# EAGLE board megacommand24 (EAGLE 7.6.0)
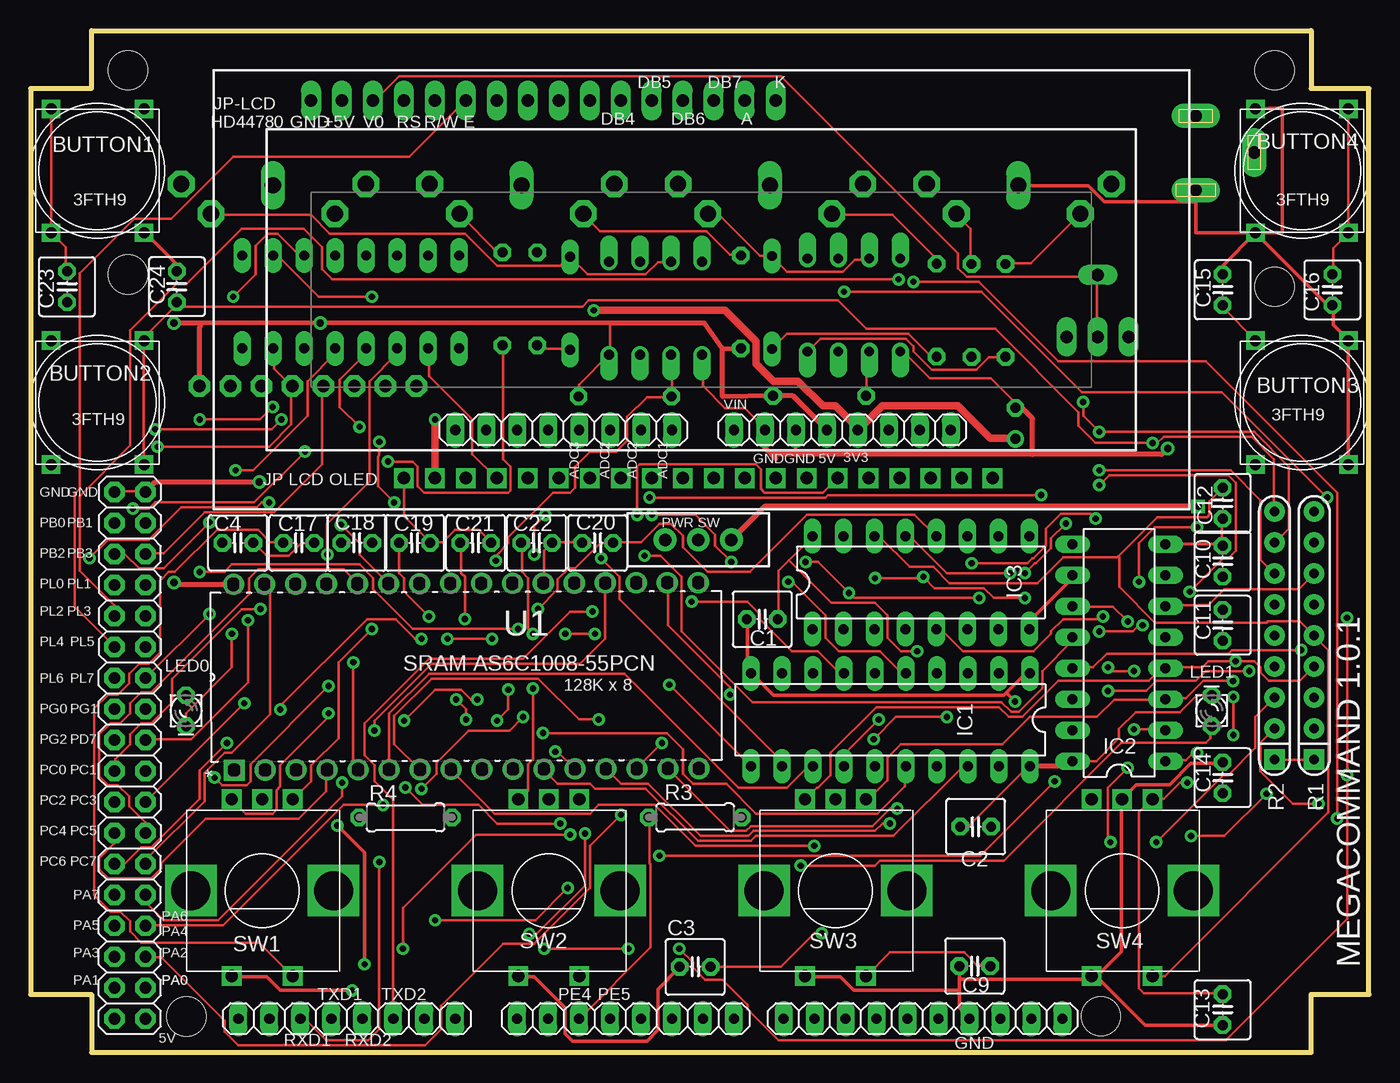
[diagram p5: board, top side]
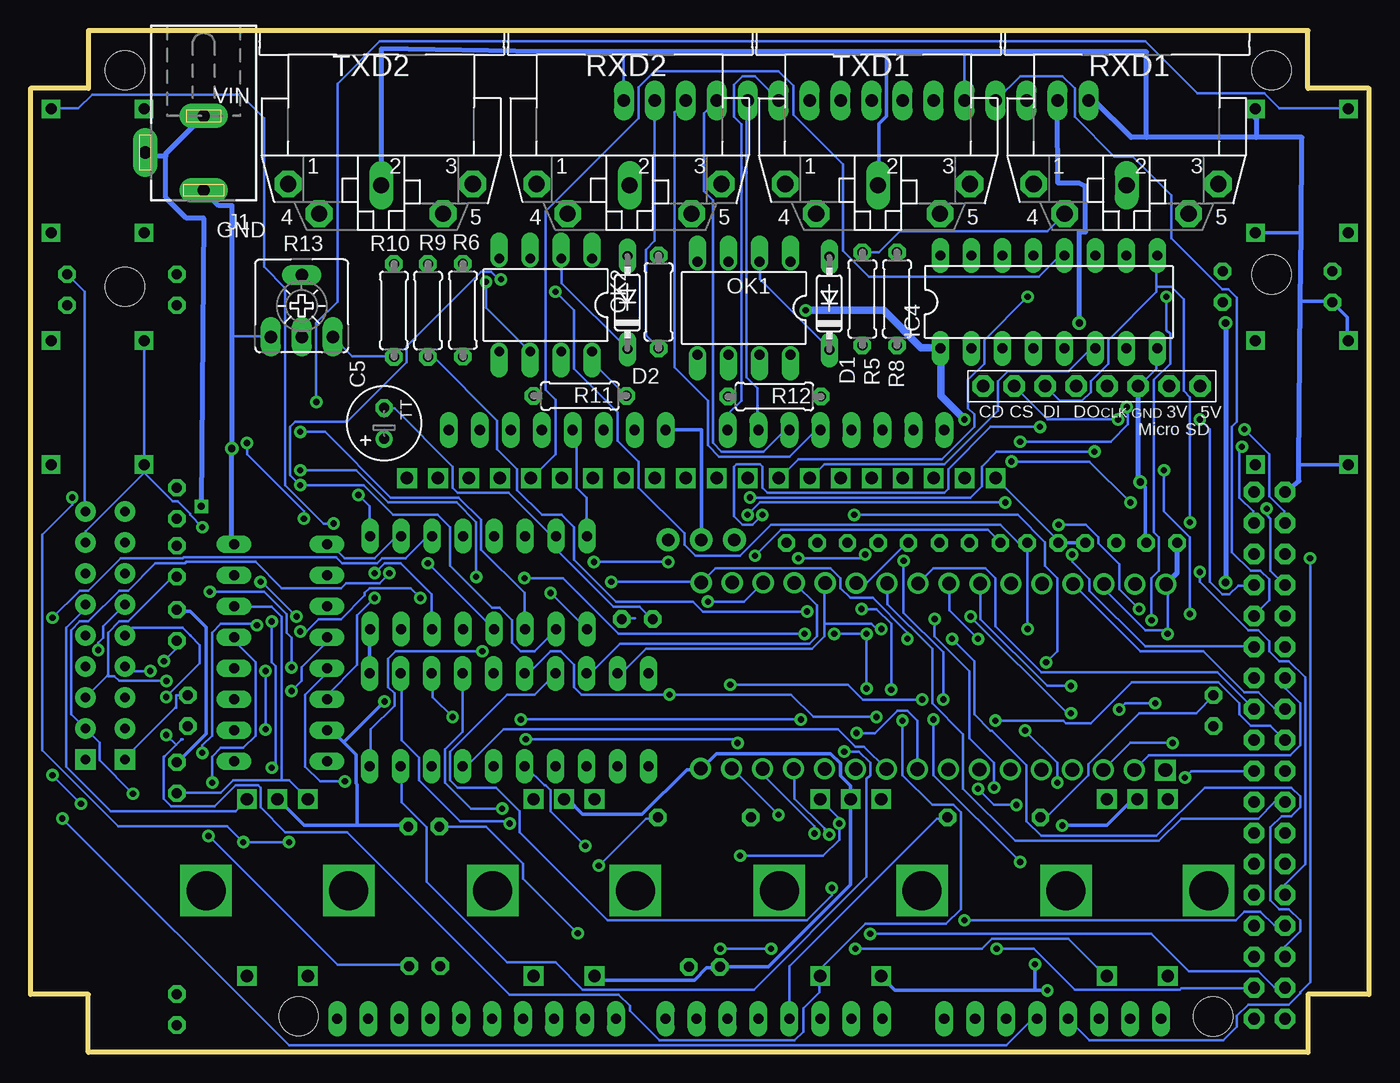
[diagram p6: board, bottom side, seen from below]

Size 109.75 x 83.75 mm. Coordinates in mm from the lower left corner, seen from the top.
Outline: 0,79 0,4.75 5,4.75 5,0 105,0 105,4.75 109.75,4.75 109.75,79 105,79 105,83.75 5,83.75 5,79 0,79
Copper layers (1*16): Top 0.035mm / dielectric 1.5mm / Bottom 0.035mm
Design rules "SparkFun": minimum track width 8mil, minimum drill 20mil, track to track 8mil, track to pad 8mil, pad to pad 8mil, via to via 8mil, smd to smd 8mil, copper to edge 10mil, drill to drill 8mil, minimum pad ring 12mil, minimum via ring 10mil, stop-mask expansion 4mil, vias tented up to drill 25mil, thermal gap 10mil
Net classes: 0 default: width 0.203 mm, drill 0.406 mm, clearance 0.203 mm; 1 power: width 0.61 mm, drill 0.406 mm, clearance 0.203 mm; 2 gnd: width 0.305 mm, drill 0.406 mm, clearance 0.203 mm; 3 power usb: width 0.508 mm, drill 0.406 mm, clearance 0.203 mm
Holes 3.2 mm at 87.77,2.95 12.79,2.92 8,63.75 102,62.75 8,80.5 102,80.5

## Footprints (pad centres in the part's own frame; a part is rotated, then mirrored left to right if it is on the bottom)
1X08 = drill 0.85 pad 1.422 long: 1 -8.89,0; 2 -6.35,0; 3 -3.81,0; 4 -1.27,0; 5 1.27,0; 6 3.81,0; 7 6.35,0; 8 8.89,0
3FT = drill 0.9 square: P$1 5.08,3.81; P$2 -5.08,3.81; P$3 5.08,-3.81; P$4 -5.08,-3.81
C025-050X050 = drill 0.813 octagon: 1 -1.27,0; 2 1.27,0
TT2D6 = drill 0.813: + -1.27,0 | drill 0.813 octagon: - 1.27,0
DO35-7 = drill 0.813 long: A 3.81,0; C -3.81,0
DIL20 = drill 0.813 long: 1 -11.43,-3.81; 2 -8.89,-3.81; 3 -6.35,-3.81; 4 -3.81,-3.81; 5 -1.27,-3.81; 6 1.27,-3.81; 7 3.81,-3.81; 8 6.35,-3.81; 9 8.89,-3.81; 10 11.43,-3.81; 11 11.43,3.81; 12 8.89,3.81; 13 6.35,3.81; 14 3.81,3.81; 15 1.27,3.81; 16 -1.27,3.81; 17 -3.81,3.81; 18 -6.35,3.81; 19 -8.89,3.81; 20 -11.43,3.81
DIL16 = drill 0.813 long: 1 -8.89,-3.81; 2 -6.35,-3.81; 3 -3.81,-3.81; 4 -1.27,-3.81; 5 1.27,-3.81; 6 3.81,-3.81; 7 6.35,-3.81; 8 8.89,-3.81; 9 8.89,3.81; 10 6.35,3.81; 11 3.81,3.81; 12 1.27,3.81; 13 -1.27,3.81; 14 -3.81,3.81; 15 -6.35,3.81; 16 -8.89,3.81
DCJ0202 = drill 1 pad 2 long: 1 0,3.1; 2 4.8,0; 3 0,-3
1X08-BIG = drill 1.016 pad 1.778 octagon: 1 -8.89,0; 2 -6.35,0; 3 -3.81,0; 4 -1.27,0; 5 1.27,0; 6 3.81,0; 7 6.35,0; 8 8.89,0
1X10 = drill 0.85 pad 1.422 long: 1 -11.43,0; 2 -8.89,0; 3 -6.35,0; 4 -3.81,0; 5 -1.27,0; 6 1.27,0; 7 3.81,0; 8 6.35,0; 9 8.89,0; 10 11.43,0
LED_LD260 = drill 0.813 octagon: A -1.27,0; K 1.27,0
DIL08 = drill 0.813 offset: 1 -3.81,-3.81; 2 -1.27,-3.81; 3 1.27,-3.81; 4 3.81,-3.81; 5 3.81,3.81; 6 1.27,3.81; 7 -1.27,3.81; 8 -3.81,3.81
RPACK-SIP-PTH-8 = drill 0.8 pad 1.676 square: P$1 0,0 | drill 0.8 pad 1.676: P$2 0,-2.54; P$3 0,-5.08; P$4 0,-7.62; P$5 0,-10.16; P$6 0,-12.7; P$7 0,-15.24; P$8 0,-17.78; P$9 0,-20.32
0207/7 = drill 0.813 octagon: 1 -3.81,0; 2 3.81,0
CA6V = drill 1.016 long: A -2.54,-2.54; E 2.54,-2.54; S 0,2.54; S1 0,-2.54
SWITCH-SPDT_KIT = drill 1.016 pad 1.88: 1 0,2.718; 2 0,0; 3 0,-2.718
ALPS_EC12E_SW = drill 1 square: A -2.5,-7.5; B 2.5,-7.5; C 0,-7.5; D -2.5,7; E 2.5,7 | drill 3.2 square: GND1 -5.85,0; GND2 5.85,0
DIP254P1524X393-32 = drill 1.118 square: 1 -15.24,38.1 | drill 1.118: 2 -15.24,35.56; 3 -15.24,33.02; 4 -15.24,30.48; 5 -15.24,27.94; 6 -15.24,25.4; 7 -15.24,22.86; 8 -15.24,20.32; 9 -15.24,17.78; 10 -15.24,15.24; 11 -15.24,12.7; 12 -15.24,10.16; 13 -15.24,7.62; 14 -15.24,5.08; 15 -15.24,2.54; 16 -15.24,0; 17 0,0; 18 0,2.54; 19 0,5.08; 20 0,7.62; 21 0,10.16; 22 0,12.7; 23 0,15.24; 24 0,17.78; 25 0,20.32; 26 0,22.86; 27 0,25.4; 28 0,27.94; 29 0,30.48; 30 0,33.02; 31 0,35.56; 32 0,38.1
LCD-16X2-3HOLES = drill 1.016 long: 1 -32,15.5; 2 -29.46,15.5; 3 -26.92,15.5; 4 -24.38,15.5; 5 -21.84,15.5; 6 -19.3,15.5; 7 -16.76,15.5; 8 -14.22,15.5; 9 -11.68,15.5; 10 -9.14,15.5; 11 -6.6,15.5; 12 -4.06,15.5; 13 -1.52,15.5; 14 1.02,15.5; 15 3.56,15.5; 16 6.1,15.5
20PIN = drill 1.016 square: P$1 -24.13,0; P$2 -21.59,0; P$3 -19.05,0; P$4 -16.51,0; P$5 -13.97,0; P$6 -11.43,0; P$7 -8.89,0; P$8 -6.35,0; P$9 -3.81,0; P$10 -1.27,0; P$11 1.27,0; P$12 3.81,0; P$13 6.35,0; P$14 8.89,0; P$15 11.43,0; P$16 13.97,0; P$17 16.51,0; P$18 19.05,0; P$19 21.59,0; P$20 24.13,0
CP-2350 = drill 1.321 pad 2.184 octagon: 1 7.62,12.58; 3 -7.52,12.58; 4 5.08,15.02; 5 -5.08,15.02 | drill 1.321 long: 2 0,12.68
2X18 = drill 0.95 pad 1.676 octagon: 1 -21.59,-1.27; 2 -21.59,1.27; 3 -19.05,-1.27; 4 -19.05,1.27; 5 -16.51,-1.27; 6 -16.51,1.27; 7 -13.97,-1.27; 8 -13.97,1.27; 9 -11.43,-1.27; 10 -11.43,1.27; 11 -8.89,-1.27; 12 -8.89,1.27; 13 -6.35,-1.27; 14 -6.35,1.27; 15 -3.81,-1.27; 16 -3.81,1.27; 17 -1.27,-1.27; 18 -1.27,1.27; 19 1.27,-1.27; 20 1.27,1.27; 21 3.81,-1.27; 22 3.81,1.27; 23 6.35,-1.27; 24 6.35,1.27; 25 8.89,-1.27; 26 8.89,1.27; 27 11.43,-1.27; 28 11.43,1.27; 29 13.97,-1.27; 30 13.97,1.27; 31 16.51,-1.27; 32 16.51,1.27; 33 19.05,-1.27; 34 19.05,1.27; 35 21.59,-1.27; 36 21.59,1.27

## Placement (x,y rotation side)
ADCL  8x1F-H8.5  [1X08]  43.71,51.01 180 top
BUTTON1  3FT1D  [3FT]  5.5,72.25 270 top
BUTTON2  3FT1D  [3FT]  5.5,53.25 90 top
BUTTON3  3FT1D  [3FT]  104.25,53.25 90 top
BUTTON4  3FT1D  [3FT]  104.25,72.25 90 top
C1  0.1uF  [C025-050X050]  60,35.5 0 top
C2  0.1uF  [C025-050X050]  77.5,18.5 180 top
C3  0.1uF  [C025-050X050]  54.5,7 0 top
C4  0.1uF  [C025-050X050]  17,41.75 180 top
C5  220uF  [TT2D6]  80.75,51.55 90 bottom
C9  0.1uF  [C025-050X050]  77.42,7.07 0 top
C10  0.1uF  [C025-050X050]  97.75,40.25 270 top
C11  0.1uF  [C025-050X050]  97.75,35 270 top
C12  0.1uF  [C025-050X050]  97.75,45 90 top
C13  0.1uF  [C025-050X050]  97.75,3.5 90 top
C14  0.1uF  [C025-050X050]  97.75,22.5 270 top
C15  0.1uF  [C025-050X050]  97.75,62.5 270 top
C16  0.1uF  [C025-050X050]  106.75,62.5 90 top
C17  0.1uF  [C025-050X050]  22,41.75 180 top
C18  0.1uF  [C025-050X050]  26.75,41.75 0 top
C19  0.1uF  [C025-050X050]  31.5,41.75 180 top
C20  0.1uF  [C025-050X050]  46.5,41.75 0 top
C21  0.1uF  [C025-050X050]  36.5,41.75 180 top
C22  0.1uF  [C025-050X050]  41.5,41.75 180 top
C23  0.1uF  [C025-050X050]  3,62.75 90 top
C24  0.1uF  [C025-050X050]  12,62.75 270 top
COMMUNICATION  8x1F-H8.5  [1X08]  25.93,2.75 0 top
D1  1N4148  [DO35-7]  44.25,61.38 90 bottom
D2  1N4148  [DO35-7]  60.8,61.46 90 bottom
IC1  74HC573N  [DIL20]  70.5,27.25 180 top
IC2  74LS165N  [DIL16]  89.25,32.75 90 top
IC3  74LS165N  [DIL16]  73,38.5 0 top
IC4  HC4050  [DIL16]  26.25,61.5 0 bottom
J1  DCJ0202  [DCJ0202]  95.55,73.75 180 bottom
JP1  [1X08-BIG]  22.74,54.61 180 bottom
JP6  10x1F-H8.5  [1X10]  73.17,2.75 180 top
LED0  5mm LED  [LED_LD260]  12.75,28 270 top
LED1  5mm LED  [LED_LD260]  96.85,28 90 top
OK1  6N137  [DIL08]  51.25,61 180 bottom
OK2  6N137  [DIL08]  67.5,61.25 180 bottom
POWER  8x1F-H8.5  [1X08]  66.57,51.01 180 top
PWML  8x1F-H8.5  [1X08]  48.79,2.75 0 top
R1  4609X-AP1-103LF  [RPACK-SIP-PTH-8]  105.25,24 180 top
R2  10K 4609X-AP1-103LF  [RPACK-SIP-PTH-8]  102,24 180 top
R3  220  [0207/7]  54.5,19.25 0 top
R4  220  [0207/7]  30.75,19.25 180 top
R5  220  [0207/7]  41.55,61.75 270 bottom
R6  220  [0207/7]  74.3,60.83 270 bottom
R7  220  [0207/7]  58.25,61.5 270 bottom
R8  220  [0207/7]  38.7,61.75 270 bottom
R9  220  [0207/7]  77.16,60.8 270 bottom
R10  220  [0207/7]  79.95,60.8 270 bottom
R11  1k  [0207/7]  64.7,53.8 0 bottom
R12  1k  [0207/7]  48.75,53.75 0 bottom
R13  10k  [CA6V]  87.51,61.18 0 bottom
S1  EG1218  [SWITCH-SPDT_KIT]  54.75,42 90 top
SW1  PEC11  [ALPS_EC12E_SW]  19,13.25 180 top
SW2  PEC11  [ALPS_EC12E_SW]  42.5,13.25 180 top
SW3  PEC11  [ALPS_EC12E_SW]  66,13.25 180 top
SW4  PEC11  [ALPS_EC12E_SW]  89.5,13.25 180 top
U1  [DIP254P1524X393-32]  54.75,38.5 90.2 top
U$1  LCD-HD4478016X2-3-HOLES  [LCD-16X2-3HOLES]  55,62.5 0 top
U$2  20PIN  [20PIN]  54.75,47.06 0 top
U$7  MIDIJACK  [CP-2350]  81,83.75 180 bottom
U$8  MIDIJACK  [CP-2350]  60.62,83.75 180 bottom
U$9  MIDIJACK  [CP-2350]  40.25,83.75 180 bottom
U$10  MIDIJACK  [CP-2350]  19.88,83.75 180 bottom
XIO  18x2F-H8.5  [2X18]  8.15,24.34 90 top

## Tracks (layer width: path | path; a pad name or v marks a point on that pad's centre or on a via)
+3V3  (via drill 0.51)
  Top 0.61: v33.18,51.87 33.18,47.1 U$2.P$2 | C5.+ 80.72,50.35 78.69,50.35 76.05,52.99 69.85,52.99 67.92,51.06 POWER.4 67.72,51.26 65.99,52.99 64.98,52.99 62.95,55.02 60.91,55.02 59.49,56.44 59.49,58.27 56.95,60.81 v46.18,60.81
  Bottom 0.61: v33.18,51.87 35.11,53.8 35.11,57.66 IC4.1 35.41,57.76 36.73,57.76 39.78,60.81 v46.18,60.81
+5V  (via drill 0.51, 0.6)
  Top 0.203: v64.88,9.75 64.27,9.75 61.52,7.01 55.83,7.01 C3.2 | R1.P$1 105.21,23.98 102.06,23.98 R2.P$1 | 16.01,38.2 U1.32 | 97.49,29.26 97.69,29.26 LED1.K 96.75,29.25 95.62,29.25 94.25,27.88 90.62,27.88 89.25,26.5 89.25,25.75 87.38,23.88 85.62,23.88 IC2.16 85.6,23.98 | C2.2 76.25,18.59 76.97,18.59 81.74,23.37 IC1.20 | R12.2 44.96,53.8 44.96,54.72 47.4,57.15 OK1.8 47.5,57.26 47.5,59.69 47.5,59.77 | 62.18,40.34 64.06,42.22 IC3.16 | 62.18,40.34 61.32,39.48 61.32,35.51 C1.2 | v16.51,34.29 16.51,31.55 12.76,27.79 12.76,26.78 LED0.K | 56.75,57.56 56.85,57.56 56.76,57.68 | R10.2 79.91,56.95 78.59,56.95 77.58,55.94 73.92,55.94 72.39,57.46 72.39,57.87 71.78,58.48 64.77,58.48 63.76,57.46 OK2.8 | v72.7,32.87 71.38,32.87 70.26,33.99 70.26,35.82 69.24,36.83 65.69,36.83 62.18,40.34
  Top 0.406: POWER.5 62.51,53.8 R11.2 56.75,53.75 56.75,57.56 56.75,57.67 | R7.2 56.76,57.68 55.25,59.77 47.5,59.77 v23.75,59.78 14,59.77 | 14,59.77 13.85,59.35 JP1.1 | 14,59.77 v11.75,59.77 | v11.75,38.5 11.88,38.37 U1.32 | IC2.16 85.02,23.44 IC1.20
  Bottom 0.203: v64.88,9.75 69.35,14.22 69.35,15.44 72.39,18.49 76.15,18.49 C2.2 | 97.79,28.25 | 97.79,28.25 97.79,29.26 LED1.K | 101.96,24.08 R2.P$1 102,24.12 97.88,28.25 97.79,28.25 | 60.2,35.56 61.22,35.56 C1.2 | R10.2 80.01,57.05 83.37,57.05 84.89,58.58 R13.E | OK2.8 63.66,57.36 63.66,56.54 60.91,53.8 R11.2 | 16.51,34.6 16.51,38.26 U1.32 | U$1.15 58.58,77.98 58.58,66.5 59.29,65.79 59.29,58.78 58.27,57.76 R7.2 | 16.51,34.6 18.34,34.6 21.7,37.95 21.7,38.36 U1.30 | 16.51,34.6 v16.51,34.29 | IC3.16 64.16,42.32 64.16,45.47 64.98,46.28 64.98,50.65 65.28,50.96 POWER.5 | v72.7,32.87 79.81,32.87 80.42,32.26 80.42,29.93 79.91,29.42 79.91,28.4 81.84,26.47 81.84,23.52 IC1.20
  Bottom 0.406: v11.75,59.77 v11.75,38.5 | U1.32 15.73,39.29 C4.2 | v23.75,59.78 23.75,67.25 23.25,67.25 23.25,71 23.75,71.25 25.5,71.25 25.54,77.04 U$1.2
ADC0
  Bottom 0.203: ADCL.1 52.58,51.06 52.58,52.28 51.46,53.4 51.46,76.05 52.07,76.66 52.07,79.3 51.36,80.01 50.35,80.01 48.42,78.08 U$1.11
ADC1
  Bottom 0.203: ADCL.2 50.14,51.06 50.14,54.41 51.06,55.33 51.06,77.88 50.96,77.98 U$1.12
ADC2
  Bottom 0.203: ADCL.3 47.6,50.96 47.91,50.96 49.64,49.23 53.09,49.23 53.8,49.94 53.8,69.85 54.51,70.56 54.51,76.97 53.5,77.98 U$1.13
ADC3
  Bottom 0.203: ADCL.4 45.06,50.96 45.37,50.96 47.5,48.82 53.29,48.82 54.21,49.74 54.21,53.4 56.95,56.14 56.95,77.07 56.04,77.98 U$1.14
GND  (via drill 0.51, 0.6)
  Top 0.203: C20.1 45.16,41.81 42.83,41.81 C22.1 42.73,41.71 42.12,41.1 42.12,38.46 U1.22 | 32.77,41.81 33.79,41.81 34.8,42.83 36.73,42.83 37.75,41.81 C21.1 | 32.77,41.81 30.64,43.95 30.64,46.99 U$2.P$1 | 32.77,41.81 C19.1 | OK1.5 55.12,57.15 55.12,54.61 56.95,52.78 58.58,52.78 59.69,51.67 POWER.7 | C12.1 97.69,43.64 97.69,41.71 C10.1 | XIO.35 9.3,45.98 6.96,45.98 XIO.36 | C17.1 23.22,41.71 22.2,41.71 21.19,40.7 19.36,40.7 18.34,41.71 C4.1 | 80.83,52.78 C5.- 80.75,53.25 78.75,55.25 73.75,55.25 71.75,57.25 OK2.5
  Top 0.254: C10.1 97.63,41.64 IC2.8
  Top 0.305: v26.37,5.08 20.48,5.08 19.36,6.2 16.51,6.2 SW1.E | v25.15,18.59 27.39,16.36 v27.39,7.21 | IC2.10 85.4,39.01 85.4,38.81 81.94,35.36 81.94,34.75 IC3.8 | C1.1 58.78,35.46 58.78,31.29 58.98,31.09 IC1.10 59.19,30.99 60.91,29.26 79.81,29.26 80.01,29.46 | 80.01,29.46 81.54,30.99 81.84,30.99 IC1.1 | C14.1 97.69,23.67 95.15,23.67 93.42,21.95 90.68,21.95 89.56,20.83 SW4.C 89.46,20.62 89.46,8.23 87.53,6.3 SW4.E | 76.15,5.08 76.15,3.66 76.97,2.85 JP6.4 | 76.15,5.08 76.15,5.99 | 76.15,5.99 76.15,7.01 C9.1 | C13.1 97.69,2.23 91.39,2.23 87.43,6.2 87.02,6.2 SW4.E | 76.15,5.99 86.82,5.99 86.92,6.1 SW4.E | 76.15,5.08 67.52,5.08 66.4,6.2 63.55,6.2 SW3.E | v80.72,28.75 80.01,29.46 | SW2.E 40.09,6.2 41.3,6.2 43.84,3.66 43.84,1.52 44.45,0.91 50.55,0.91 51.46,1.83 51.46,5.18 53.19,6.91 C3.1 | C24.1 11.94,64.11 11.94,64.62 9.4,67.16 BUTTON1.P$1 | 59.8,51.61 60.2,51.21 POWER.7 | 62.74,49 62.74,51 POWER.6 | BUTTON3.P$4 108.06,48.26 108.06,58.22 BUTTON3.P$3 108.06,58.42 106.84,59.64 106.84,61.16 C16.1 106.63,61.27 106.33,61.27 100.54,67.06 BUTTON4.P$2 | 100.44,67.16 97.79,64.52 97.79,63.81 C15.1 | 100.44,67.16 BUTTON4.P$2 | BUTTON4.P$1 102.64,77.42 102.64,67.16 BUTTON4.P$2 | U$7.2 81.03,71.02 86.72,71.02 88.04,69.7 95.55,69.7 J1.1 95.55,67.16 100.44,67.16
  Top 0.406: v93.25,49.5 92.75,49 82.15,49 | 82.15,49 62.74,49 60.75,49 | 60.75,49 60.22,49.53 POWER.7 | 60.75,49 61.1,48.65 | XIO.35 10.24,46.75 v18.75,46.75 | 82.15,49 82.15,51.95 81.28,52.82 C5.-
  Bottom 0.203: C1.1 58.78,35.51 59.8,36.53 61.93,36.53 66.6,41.2 66.6,42.22 IC3.15 66.7,42.32 67.01,42.32 70.56,45.88 74.73,45.88 75.14,46.28 75.14,48.01 79.91,52.78 80.72,52.78 C5.- | U1.22 42.02,38.46 41.2,38.46 37.85,41.81 C21.1 | IC4.8 17.43,57.66 17.43,56.04 18.75,54.72 JP1.3 | 33.18,82 33.18,78.08 U$1.5 | 61.12,82 61.12,78.08 U$1.16 | 93.25,58.68 90.07,58.68 R13.A | U$2.P$1 30.54,46.99 25.45,41.91 C18.1
  Bottom 0.305: 27.39,5.08 38.87,5.08 39.98,6.2 SW2.E | 27.39,5.08 v26.37,5.08 | v25.15,18.59 21.49,18.59 19.36,20.73 19.05,20.73 SW1.C | 27.39,5.08 v27.39,7.21 | IC1.1 81.94,31.09 81.94,34.65 IC3.8 | 82.96,18.59 87.33,18.59 89.46,20.73 SW4.C | 82.96,18.59 78.8,18.59 C2.1 | 84.08,25.4 83.06,24.38 83.06,22.05 82.96,21.95 82.96,18.59 | 84.08,25.4 84.99,26.31 85.4,26.31 IC2.15 | C11.1 97.69,36.17 96.68,36.17 95.36,34.85 95.36,26.11 97.69,23.77 C14.1 | SW3.C 65.99,20.73 65.69,20.73 64.47,19.51 59.59,19.51 55.94,23.16 54.92,23.16 U1.16 54.72,23.27 53.5,24.49 44.15,24.49 43.34,23.67 43.34,22.66 42.52,21.84 42.52,20.83 SW2.C 42.52,20.62 42.52,13.72 49.23,7.01 53.09,7.01 C3.1 53.29,6.91 54.31,6.91 55.33,5.89 63.15,5.89 63.45,6.2 SW3.E | 84.08,25.4 v80.72,28.75 | C4.1 18.34,41.76 18.34,46.33 18.65,46.63 v18.75,46.75 | C18.1 25.45,41.76 23.42,41.76 C17.1 | 5.62,61.57 5.44,61.57 3,61.57 C23.1 2.9,61.37 1.78,60.25 1.78,58.42 BUTTON2.P$1 | BUTTON2.P$2 1.78,48.16 5.54,48.16 5.74,48.16 | 39.58,82 39.58,76.71 40.19,76.1 40.19,71.12 U$9.2 | BUTTON1.P$1 9.3,67.16 5.74,67.16 5.57,67.16
  Bottom 0.406: XIO.36 5.75,46.81 5.74,48.16 5.62,61.57 5.57,67.16 5.5,75 9.25,75 | 9.25,75 18.25,75 | 18.25,75 19.5,75 22.5,78 U$1.1 | BUTTON1.P$2 9.5,77.14 9.5,76.75 9.25,76.5 9.25,75 | 18.25,75 18.25,82 33.18,82 39.58,82 61.12,82 67.75,82 81,82.25 U$7.2 | IC2.8 93.25,41.83 v93.25,49.5 93.25,58.68 93.25,69.41 94.31,69.41 J1.1 | v18.75,46.75 18.93,46.93 JP1.3
INS0  (via drill 0.51)
  Top 0.203: v28,34.7 25.25,31.96 25.25,25.76 23.02,23.52 23.02,22.2 21.59,20.78 SW1.A | v89.97,35.31 88.75,36.53 85.5,36.53 IC2.11 | v89.97,23.32 88.34,21.7 88.34,17.43 v88.55,17.23 | v92.31,17.23 97.79,22.71 98.2,22.71 100.44,24.95 100.44,27.49 101.96,29.01 R2.P$3 | v66.7,62.34 77.98,62.34 86.21,54.11 97.69,54.11 v106.33,45.47
  Bottom 0.203: v28,34.7 28,41.71 C18.2 28.1,41.81 28.81,41.81 30.23,43.23 49.03,43.23 51.57,40.7 55.22,40.7 56.14,41.61 56.14,42.52 59.9,46.28 59.9,48.42 61.62,50.14 61.62,52.48 65.18,56.04 65.18,60.81 v66.7,62.34 | v89.97,35.31 89.97,31.96 89.67,31.65 89.67,23.63 v89.97,23.32 | v88.55,17.23 v92.31,17.23 93.63,18.55 102.57,18.55 108.77,24.74 108.77,42.42 106.33,44.86 v106.33,45.47
INS1  (via drill 0.51)
  Top 0.203: v88.34,29.62 91.5,29.62 92.31,30.43 95.56,30.43 96.37,31.25 v99.93,31.25 | C19.2 30.23,39.27 30.64,38.87 30.64,37.75 v32.67,35.72 | v24.44,27.79 24.44,27.49 20.48,23.52 20.48,21.8 20.17,21.49 20.17,19.87 19.87,19.56 17.63,19.56 16.51,20.68 SW1.B | v50.35,40.7 51.67,40.7 53.4,38.97 53.4,34.5 59.19,28.71 79.61,28.71 80.42,27.89 81.03,27.89 82.96,29.82 82.96,31.25 85.4,33.68 85.4,33.99 IC2.12
  Bottom 0.203: v88.34,29.62 87.53,30.43 87.53,31.55 85.5,33.58 85.5,33.99 IC2.12 | v99.93,31.25 101.66,31.25 101.96,31.55 R2.P$4 | v32.67,35.72 24.74,27.79 v24.44,27.79 | v50.35,40.7 48.21,42.83 31.25,42.83 30.23,41.81 C19.2
INS2  (via drill 0.51)
  Top 0.203: v104.19,32.97 98.5,32.97 98.2,32.67 88.24,32.67 87.13,31.55 85.5,31.55 IC2.13 | v35.62,35.51 35.62,38.97 35.31,39.27 35.31,41.71 C21.2 | v30.74,21.7 32.16,20.27 36.73,20.27 38.26,18.75 v43.44,18.75 | v83.98,22.2 77.88,16.11 v51.57,16.11
  Bottom 0.203: v104.19,32.97 104.19,33.58 103.79,33.99 103.79,34.9 102.06,36.63 R2.P$6 | v35.62,35.51 35.62,34.09 32.77,31.25 32.77,25.76 30.74,23.73 v30.74,21.7 | SW2.A 44.96,20.68 43.44,19.16 v43.44,18.75 43.44,17.43 44.76,16.11 v51.57,16.11 | v83.98,22.2 86.01,22.2 87.23,23.42 87.23,29.32 85.5,31.04 85.5,31.45 IC2.13
INS3  (via drill 0.51)
  Top 0.203: v41.2,34.29 40.8,34.7 40.8,38.87 40.29,39.37 40.29,41.71 C22.2 | v41.2,29.82 41.2,24.03 40.8,23.63 40.8,21.49 40.09,20.78 SW2.B | v81.54,37.24 79,37.24 78.19,38.05 74.12,38.05 v73.21,38.97 73.21,38.87 v69.24,38.87 | v87.63,47.7 98.4,47.7 100.84,45.27 100.84,40.39 101.96,39.27 R2.P$7 | v46.28,34.29 v43.84,34.29
  Bottom 0.203: v41.2,29.82 v41.2,34.29 v43.84,34.29 | v81.54,37.24 82.96,35.82 82.96,31.75 85.4,29.32 85.4,29.01 IC2.14 | v73.21,38.97 73.21,43.44 74.83,45.06 80.42,45.06 83.06,47.7 v87.63,47.7 | v46.28,34.29 61.52,34.29 66.09,38.87 v69.24,38.87
INS4  (via drill 0.51)
  Top 0.203: SW3.A 68.53,20.78 68.74,20.78 70.26,22.3 70.26,24.13 71.38,25.25 79.71,25.25 81.94,27.49 87.43,27.49 88.85,28.91 93.02,28.91 IC2.3 93.12,29.01 94.75,29.01 96.17,30.43 v98.61,30.43
  Bottom 0.203: 103.43,30.89 105.21,29.11 R1.P$3 | 103.43,30.89 103.38,30.94 103.38,34.4 102.47,35.31 101.76,35.31 98.1,38.97 97.79,38.97 C10.2 | v98.61,30.43 102.47,30.43 102.87,30.84 103.38,30.84 103.43,30.89
INS5  (via drill 0.51)
  Top 0.203: R1.P$4 105.21,31.55 104.09,30.43 101.55,30.43 100.84,31.14 100.84,31.55 100.33,32.06 v98.81,32.06 96.58,32.06 96.07,31.55 93.12,31.55 IC2.4 93.02,31.45 92.71,31.45 91.7,30.43 84.28,30.43 81.33,27.49 80.22,27.49 79.4,28.3 69.35,28.3 65.59,24.54 65.59,22.71 64.57,21.7 64.47,21.7 63.55,20.78 SW3.B
  Bottom 0.203: v98.81,32.06 97.79,33.08 97.79,33.68 C11.2
INS6  (via drill 0.51)
  Top 0.203: C13.2 97.69,4.83 91.29,4.83 90.89,5.24 90.89,19.66 91.9,20.68 SW4.A 92,20.78 92.92,20.78 94.24,22.1 v94.85,22.1
  Bottom 0.203: v94.85,22.1 94.85,24.24 94.14,24.95 92.31,24.95 91.29,25.96 91.29,31.96 93.02,33.68 93.02,33.99 IC2.5 | R1.P$6 105.31,36.63 105.31,36.33 106.84,34.8 106.84,23.42 103.18,19.77 92.92,19.77 92,20.68 SW4.A
INS7
  Top 0.203: IC2.6 93.12,36.63 96.58,36.63 97.9,37.95 103.99,37.95 105.21,39.17 R1.P$7
  Bottom 0.203: 89.16,22.3 88.55,22.3 87.02,20.78 SW4.B | 89.16,22.3 93.12,22.3 94.14,21.29 97.69,21.29 C14.2 | 89.16,22.3 89.16,35.72 89.97,36.53 93.02,36.53 IC2.6
INS8  (via drill 0.51)
  Top 0.203: v107.95,35.62 v107.95,22.71 107.95,10.93 98,0.97 61.32,0.97 58.78,3.51 58.78,3.92 56.75,5.95 55.33,5.95 54.31,6.96 54.31,7.37 v53.19,8.49 | v105.62,20.38 103.48,20.38 100.84,23.02 100.84,25.35 101.96,26.47 R2.P$2 | C17.2 20.68,41.81 19.66,41.81 18.65,42.83 15.29,42.83 11.84,39.37 11.33,39.37 10.62,38.66 10.62,32.77 9.71,31.86 8.89,31.86 8.08,31.04 8.08,30.23 7.17,29.32 6.35,29.32 5.24,28.2 5.24,12.86 6.56,11.54 7.37,11.54 8.18,10.72 8.18,9.91 9.1,9 18.75,9 SW1.D | v42.12,8.49 v49.03,8.49
  Bottom 0.203: v107.95,35.62 105.72,37.85 105.01,37.85 102.37,40.49 97.29,40.49 97.18,40.59 84.69,40.59 84.18,40.09 81.33,40.09 80.93,40.49 79,40.49 77.27,42.22 76.86,42.22 IC3.11 | v105.62,20.38 v107.95,22.71 | v49.03,8.49 v53.19,8.49 | v42.12,8.49 31.75,8.49 30.94,9.3 24.64,9.3 21.59,6.25 SW1.D
INS9  (via drill 0.51)
  Top 0.203: IC3.12 74.22,42.32 72.5,44.05 63.66,44.05 58.98,39.37 55.53,39.37 53.5,41.41 53.5,42.32 52.48,43.34 51.57,43.34 50.04,41.81 47.81,41.81 C20.2 47.7,41.71 46.69,41.71 44.66,39.68 44.15,39.68 43.23,38.76 43.23,37.95 v41.61,36.33 | v39.17,29.72 39.17,28.1 v38.26,27.18 | v98.62,29.12 v98.62,26
  Bottom 0.203: 97.29,25.66 97.38,25.66 | 97.38,25.66 97.39,25.66 | R2.P$5 101.96,34.19 101.35,34.8 97.29,34.8 96.68,34.19 96.62,34.12 95.88,33.38 95.88,31.88 v98.62,29.12 | v41.61,36.33 40.39,36.33 39.17,35.11 v39.17,29.72 | v38.26,27.18 38.26,22.71 35.82,20.27 34.09,20.27 33.48,19.66 33.48,11.74 34.7,10.52 41.3,10.52 44.96,6.86 44.96,6.25 SW2.D 45.06,6.15 45.06,4.93 46.38,3.61 46.38,1.68 47.1,0.97 58.17,0.97 60.61,3.41 60.61,3.81 61.52,4.73 70.46,4.73 83.77,18.04 88.85,18.04 90.89,20.07 90.89,21.7 91.09,21.9 92.92,21.9 94.64,20.17 98.2,20.17 98.81,20.78 98.81,24.24 98.75,24.25 97.81,25.19 | 97.81,25.19 97.38,25.62 97.38,25.66 | v98.62,26 97.81,25.19
INS10  (via drill 0.51)
  Top 0.203: C9.2 78.59,7.17 77.58,7.17 76.56,8.18 70.46,8.18 68.53,6.25 SW3.D | v80.32,39.27 75.14,39.27 72.19,42.22 71.78,42.22 IC3.13 | v95.15,17.73 97.9,17.73 v101.35,21.19
  Bottom 0.203: v80.32,39.27 81.13,38.46 83.88,38.46 84.28,38.05 89.16,38.05 91.29,40.19 96.98,40.19 97.08,40.09 99.52,40.09 101.76,37.85 102.47,37.85 105.01,35.31 105.72,35.31 106.43,34.6 106.43,27.69 105.31,26.57 R1.P$2 105.21,26.47 104.09,25.35 104.09,23.93 v101.35,21.19 | v95.15,17.73 84.59,7.17 78.69,7.17 C9.2
INS11
  Top 0.203: 89.21,40.64 92.41,43.84 96.47,43.84 96.68,44.05 96.68,45.16 97.69,46.18 C12.2 | 89.21,40.64 89.16,40.59 84.69,40.59 82.55,38.46 75.34,38.46 74.02,39.78 72.09,39.78 69.65,42.22 69.24,42.22 IC3.14 | SW4.D 93.02,6.25 106.43,19.66 106.43,32.97 105.31,34.09 R1.P$5 105.21,34.19 104.09,35.31 101.45,35.31 101.35,35.21 92.21,35.21 89.26,38.16 89.26,40.59 89.21,40.64
INS12  (via drill 0.51)
  Top 0.203: C23.2 2.9,64.06 2.9,65.99 1.78,67.11 BUTTON1.P$3 1.68,67.21 1.68,77.27 BUTTON1.P$4 | R2.P$8 102.06,41.81 103.18,42.93 103.18,48.01 100.33,50.85 v87.63,50.85 86.31,52.18 v86.31,53.29
  Bottom 0.203: v87.63,50.85 85.6,50.85 80.22,45.47 74.63,45.47 72.8,43.64 72.8,41.2 69.24,37.65 69.24,34.7 IC3.3 | v86.31,53.29 86.31,59.8 84.59,61.52 84.59,79.4 81.13,82.86 18.34,82.86 14.08,78.59 8.59,78.59 7.37,77.37 1.78,77.37 BUTTON1.P$4
INS13  (via drill 0.51)
  Top 0.203: BUTTON2.P$4 9.3,48.21 9.3,58.27 BUTTON2.P$3 9.4,58.37 9.4,58.68 11.94,61.22 11.94,61.42 C24.2 11.94,61.12 45.27,61.12 45.77,61.62 66.2,61.62 68.53,59.29 79.1,59.29 85.91,52.48 85.91,51.36 87.33,49.94 v92,49.94 92.41,49.94 92.92,50.45 100.13,50.45 101.96,48.62 101.96,44.35 R2.P$9 | v77.17,40.09 81.74,40.09 82.15,40.49 82.25,40.49 83.27,41.51 83.27,42.93 84.48,44.15 86.92,44.15 v87.33,43.74
  Bottom 0.203: v77.17,40.09 71.78,34.7 IC3.4 | v87.33,43.74 87.33,44.35 92,49.03 v92,49.94
INS14  (via drill 0.51)
  Top 0.203: C15.2 97.79,61.22 97.79,61.02 100.44,58.37 BUTTON3.P$1 | v87.94,35.72 87.74,35.51 84.69,35.51 83.67,34.5 83.67,34.29 82.25,32.87 76.46,32.87 74.73,34.6 74.32,34.6 IC3.5 | v90.89,38.56 90.89,41.71 92.21,43.03 v95.66,43.03
  Bottom 0.203: v87.94,35.72 90.78,38.56 v90.89,38.56 | v95.66,43.03 96.68,44.05 96.68,44.15 97.69,45.16 98.1,45.16 100.44,47.5 | 100.44,47.5 100.44,48.11 BUTTON3.P$2 | 100.44,47.5 105.21,42.73 105.21,41.81 R1.P$8 | 100.44,47.5 BUTTON3.P$2 | BUTTON3.P$1 100.44,58.27 100.44,48.21 BUTTON3.P$2
INS15  (via drill 0.51)
  Top 0.203: C16.2 106.84,63.86 106.84,65.89 108.06,67.11 BUTTON4.P$4 108.06,67.21 108.06,77.27 BUTTON4.P$3 | v81.54,39.27 82.35,40.09 82.45,40.09 83.67,41.3 83.67,42.12 v84.89,43.34
  Bottom 0.203: R1.P$9 105.31,44.35 105.31,62.34 106.73,63.76 C16.2 | v81.54,39.27 80.72,40.09 79.4,40.09 76.86,37.55 76.86,34.7 IC3.6 | v84.89,43.34 85.7,43.34 88.85,46.49 88.85,62.64 90.58,64.37 90.58,76.56 92.51,78.49 104.7,78.49 105.82,77.37 108.06,77.37 BUTTON4.P$3
N$1
  Top 0.203: R8.1 38.66,65.59 38.26,65.59 35.21,68.64 U$9.5
N$3
  Bottom 0.203: R4.2 26.88,19.26 26.47,19.26 23.02,22.71 23.02,23.63 18.85,27.79 14.18,27.79 12.76,29.21 LED0.A
N$4
  Top 0.203: IC1.13 64.06,23.42 63.76,23.42 62.03,21.7 58.07,21.7 48.72,31.04 32.67,31.04 29.42,27.79 29.42,23.22 U1.6
N$5  (via drill 0.51)
  Top 0.203: v43.03,24.64 43.23,24.64 44.56,23.32 U1.12
  Bottom 0.203: v43.03,24.64 41.81,24.64 40.9,23.73 40.9,22.71 41.2,22.41 41.2,14.38 50.45,5.13 64.47,5.13 66.7,7.37 70.67,7.37 77.27,13.97 77.27,18.44 79.3,20.48 79.3,23.42 IC1.19
N$6
  Top 0.203: IC1.18 76.76,23.42 76.46,23.42 70.77,17.73 59.49,17.73 59.08,17.33 54.72,17.33 50.45,21.59 46.28,21.59 45.88,22 43.23,22 42.12,23.12 U1.11
N$7
  Bottom 0.203: IC1.17 74.22,23.52 73.92,23.52 70.97,26.47 43.54,26.47 42.12,25.05 41.41,25.05 39.58,23.22 U1.10
N$8  (via drill 0.51)
  Top 0.203: v42.02,26.17 52.18,26.17 53.5,24.84 53.5,22.81 54.31,22 57.05,22 59.49,19.56 69.45,19.56 71.68,21.8 71.68,23.42 IC1.16
  Bottom 0.203: v42.02,26.17 40.49,26.17 38.66,28 37.85,28 37.04,27.18 37.04,23.22 U1.9
N$9  (via drill 0.51)
  Top 0.203: v64.27,16.92 54.51,16.92 51.16,20.27 46.59,20.27 45.88,19.56 38.05,19.56 34.5,23.12 U1.8
  Bottom 0.203: v64.27,16.92 67.11,19.77 67.11,21.49 67.52,21.9 67.62,21.9 69.14,23.42 IC1.15
N$10  (via drill 0.51)
  Top 0.203: v69.55,27.28 66.7,24.44 66.7,23.52 IC1.14 | v46.59,27.28 44.96,27.28 41.61,30.64 32.87,30.64 29.82,27.59 29.82,25.25 31.86,23.22 U1.7
  Bottom 0.203: v46.59,27.28 v69.55,27.28
N$11  (via drill 0.51)
  Top 0.203: v46.79,40.49 48.31,38.97 48.31,37.14 61.52,23.93 61.52,23.52 IC1.12 | v41.3,40.8 41.3,43.13 v42.22,44.05 | v26.47,31.96 26.47,23.52 26.78,23.22 U1.5
  Bottom 0.203: v46.79,40.49 41.61,40.49 v41.3,40.8 | v42.22,44.05 28.81,44.05 26.57,41.81 26.57,39.88 25.56,38.87 25.56,32.87 v26.47,31.96
N$12
  Bottom 0.203: IC3.10 79.4,42.22 79.81,42.22 81.54,40.49 83.98,40.49 85.09,41.61 85.4,41.61 IC2.9
N$13  (via drill 0.51)
  Top 0.203: v63.15,15.29 69.24,15.29 69.65,15.7 79.81,15.7 89.46,25.35 96.37,25.35 96.38,25.38 96.75,25.75 96.75,26.62 LED1.A 97.69,26.67
  Bottom 0.203: v63.15,15.29 59.29,19.16 58.37,19.16 R3.2
N$14
  Top 0.203: OK1.3 52.48,64.77 51.46,64.77 50.45,63.76 45.67,63.76 D1.A 44.15,65.18 43.44,64.47 38.26,64.47 35.62,67.11 24.54,67.11 23.02,68.64 14.89,68.64 U$10.5
N$15
  Bottom 0.203: R5.1 41.51,65.59 40.19,65.59 38.46,67.31 26.37,67.31 25.05,68.64 U$10.4
N$16
  Top 0.203: R7.1 58.17,65.38 57.36,65.38 55.43,67.31 46.69,67.31 45.37,68.64 U$9.4
N$17
  Top 0.203: R10.1 80.01,64.67 82.05,64.67 86.01,68.64 U$7.4
N$18
  Top 0.203: R6.2 74.22,57.05 73.82,57.05 71.99,58.88 62.03,58.88 60.81,57.66 D2.C
  Bottom 0.203: OK2.2 66.2,64.98 66.2,63.05 60.81,57.66 D2.C
N$19
  Top 0.203: U$8.5 55.63,68.64 56.44,68.64 59.8,65.28 60.71,65.28 D2.A 60.81,65.18 62.03,63.96 66.6,63.96 67.62,64.98 68.74,64.98 OK2.3
N$21
  Top 0.203: R6.1 74.22,64.67 74.22,65.08 70.67,68.64 65.79,68.64 U$8.4
N$22
  Top 0.203: R9.1 77.07,64.67 77.07,67.52 75.95,68.64 U$7.5
N$23  (via drill 0.6)
  Top 0.406: v95.75,44.75 60.22,44.75 S1.3
  Bottom 0.406: v95.75,44.75 95.55,68.38 96.98,68.38 98.65,70.05 98.65,73.45 | 98.65,73.45 98.65,73.65 J1.3 | 98.65,73.45 100.05,73.45 J1.2
N$25
  Top 0.203: IC4.2 32.67,57.66 32.67,55.43 36.22,51.87 36.22,49.03 38.16,47.1 U$2.P$4
N$26
  Top 0.203: D1.C 44.15,57.66 41.81,57.66 41.61,57.87 R5.2
  Bottom 0.203: OK1.2 49.94,64.77 49.94,63.35 44.25,57.66 D1.C
N$27
  Top 0.203: U$1.3 28.1,78.08 28.3,78.08 30.23,80.01 61.52,80.01 76.05,65.48 76.05,64.27 76.76,63.55 87.33,63.55 87.43,63.66 R13.S 87.43,63.55 87.43,58.68 R13.S1
N$28
  Bottom 0.203: IC4.6 22.51,57.66 22.81,57.66 24.64,55.83 29.62,55.83 30.43,55.02 30.43,52.58 34.8,48.21 44.66,48.21 45.77,47.1 U$2.P$7
N$29  (via drill 0.51)
  Top 0.203: v28,61.93 23.63,61.93 20.27,65.28 19.97,65.28 IC4.10
  Bottom 0.203: v28,61.93 31.55,58.37 31.55,56.44 32.87,55.12 32.87,52.78 32.36,52.28 32.36,51.26 35.01,48.62 46.79,48.62 48.31,47.1 U$2.P$8
N$30  (via drill 0.51)
  Top 0.203: v26.98,51.26 25.35,52.89 25.35,55.12 27.49,57.26 27.49,57.66 IC4.4 | v49.74,44.05 49.74,48.01 49.94,48.21 59.49,48.21 59.9,47.81 59.9,46.18 60.2,45.88 64.98,45.88 66.09,46.99 U$2.P$15
  Bottom 0.203: v26.98,51.26 31.04,51.26 34.5,47.81 34.5,46.18 34.8,45.88 49.33,45.88 49.74,46.28 49.74,48.01 49.94,48.21 51.87,48.21 52.07,48.01 52.07,43.95 51.36,43.23 50.55,43.23 v49.74,44.05
N$31
  Bottom 0.203: IC4.12 25.05,65.28 25.35,65.28 27.08,63.55 41,63.55 43.13,65.69 43.13,72.8 47.2,76.86 47.2,79.2 48.42,80.42 58.58,80.42 59.9,79.1 59.9,76.56 67.52,68.94 67.52,54.31 66.7,53.5 66.7,49.03 68.64,47.1 U$2.P$16
PA0  (via drill 0.51)
  Top 0.203: v70.46,18.75 69.85,18.75 69.24,18.14 59.29,18.14 58.88,17.73 54.92,17.73 50.65,22 48.42,22 47.2,23.22 U1.13 | v30.54,8.49 30.54,11.84 36.53,17.84 v44.25,17.84
  Bottom 0.203: v70.46,18.75 70.67,18.95 74.53,18.95 77.88,22.3 77.88,24.13 79.3,25.56 79.3,31.04 IC1.2 | v30.54,8.49 27.49,8.49 24.13,5.13 15.5,5.13 15.4,5.24 9.5,5.24 XIO.3 | v44.25,17.84 44.66,18.24 44.66,18.34 47.1,20.78 47.1,23.22 U1.13
PA1  (via drill 0.51)
  Top 0.203: v75.14,27.49 70.97,27.49 v69.14,25.66 | v51.77,25.35 49.74,23.32 U1.14 | v40.9,9.71 41.51,9.71 45.47,13.67 v45.47,17.94
  Bottom 0.203: v75.14,27.49 76.76,29.11 76.76,31.04 IC1.3 | v69.14,25.66 52.07,25.66 v51.77,25.35 | v40.9,9.71 17.84,9.71 14.79,6.66 9.1,6.66 7.78,5.34 6.96,5.34 XIO.4 | v45.47,17.94 45.47,18.55 49.64,22.71 49.64,23.22 U1.14
PA2  (via drill 0.51)
  Top 0.203: v71.07,19.97 70.46,19.97 69.04,18.55 59.08,18.55 58.68,18.14 57.36,18.14 52.28,23.22 U1.15 | v48.42,19.46 45.88,16.92 45.88,13.47 41.3,8.89 38.76,8.89 33.68,3.81 33.68,1.88 32.36,0.56 17.02,0.56 15.9,1.68 15.9,2.6 10.72,7.78 9.5,7.78 XIO.5
  Bottom 0.203: v71.07,19.97 73.61,19.97 75.75,22.1 75.75,24.84 74.32,26.27 74.32,31.04 IC1.4 | v48.42,19.46 52.18,23.22 U1.15
PA3  (via drill 0.51)
  Top 0.203: v62.13,38.56 62.44,38.56 65.18,35.82 65.18,33.99 66.3,32.87 69.65,32.87 71.38,31.14 71.68,31.14 IC1.5 | v37.85,33.89 v34.19,33.89
  Bottom 0.203: v62.13,38.56 54.82,38.56 U1.17 54.72,38.56 53.6,39.68 44.15,39.68 43.34,38.87 43.34,38.05 42.52,37.24 40.7,37.24 37.85,34.4 v37.85,33.89 | v34.19,33.89 32.36,32.06 32.36,27.69 31.04,26.37 30.94,26.37 28.1,23.52 28.1,18.95 26.88,17.73 17.43,17.73 13.47,21.7 6.35,21.7 5.64,20.98 5.64,20.07 6.35,19.36 7.17,19.36 8.08,18.44 8.08,12.45 7.37,11.74 6.56,11.74 5.64,10.82 5.64,9.91 6.86,8.69 6.86,7.88 XIO.6
PA4  (via drill 0.51)
  Top 0.203: v57.36,29.32 57.36,29.93 52.28,35.01 52.28,38.46 U1.18 | v28.91,20.27 25.66,20.27 15.8,10.42 9.5,10.42 XIO.7 | v32.06,21.59 33.28,22.81 33.28,23.73 35.92,26.37 39.27,26.37 v40.39,27.49
  Bottom 0.203: IC1.6 69.14,31.14 68.84,31.14 67.11,32.87 66.3,32.87 65.18,31.75 65.18,29.93 64.57,29.32 v57.36,29.32 47.4,29.32 45.57,27.49 v40.39,27.49 | v28.91,20.27 30.74,20.27 v32.06,21.59
PA5  (via drill 0.51)
  Top 0.203: v54.21,36.94 58.78,36.94 59.8,35.92 59.8,35.51 62.44,32.87 64.57,32.87 66.3,31.14 66.6,31.14 IC1.7 | v33.18,10.82 41.41,10.82 v44.05,13.47
  Bottom 0.203: v54.21,36.94 51.26,36.94 49.74,38.46 U1.19 | v33.18,10.82 10.93,10.82 10.21,11.54 8.89,11.54 7.78,10.42 6.96,10.42 XIO.8 | v44.05,13.47 44.05,12.86 46.08,10.82 62.44,10.82 69.65,18.04 69.65,19.77 71.58,21.7 74.73,21.7 75.34,22.3 75.34,24.64 70.67,29.32 68.43,29.32 66.7,31.04 IC1.7
PA6  (via drill 0.51)
  Top 0.203: v25.56,22.1 25.56,20.98 15.4,10.82 10.93,10.82 9.5,12.25 9.5,12.86 XIO.9 | v28.2,26.37 28.2,27.18 32.87,31.86 45.06,31.86 47.1,33.89 47.1,38.46 U1.20
  Bottom 0.203: IC1.8 64.06,31.14 63.76,31.14 61.42,33.48 45.88,33.48 45.27,34.09 45.27,36.63 47.1,38.46 U1.20 | v25.56,22.1 25.56,23.73 v28.2,26.37
PA7  (via drill 0.51)
  Top 0.203: v13.87,39.37 15.9,39.37 16.51,39.98 26.98,39.98 28.1,38.87 28.1,37.95 31.35,34.7 v39.98,34.7
  Bottom 0.203: 44.66,35.11 44.66,38.46 U1.21 | 44.66,35.11 44.66,34.09 45.67,33.08 59.29,33.08 61.22,31.14 61.52,31.14 IC1.9 | v13.87,39.37 13.87,38.56 9.91,34.6 9.1,34.6 8.18,33.68 8.18,32.87 7.37,32.06 6.56,32.06 5.24,30.74 5.24,15.4 6.86,13.77 6.86,12.96 XIO.10 | v39.98,34.7 40.39,34.7 40.8,35.11 44.66,35.11
PB0  (via drill 0.51)
  Top 0.203: v10.21,51.06 19.77,51.06 v20.58,51.87
  Bottom 0.203: v10.21,51.06 8.18,49.03 8.18,45.57 6.96,44.35 6.96,43.44 XIO.34 | v20.58,51.87 26.37,51.87 29.01,54.51 JP1.7
PB1  (via drill 0.51)
  Top 0.203: IC4.7 19.97,57.66 19.97,56.04 21.39,54.61 JP1.4 21.39,54.51 21.39,51.46 19.56,49.64 v10.42,49.64
  Bottom 0.203: v10.42,49.64 10.62,49.43 10.62,45.47 9.5,44.35 9.5,43.44 XIO.33
PB2  (via drill 0.51)
  Top 0.203: v14.69,43.44 10.93,39.68 8.89,39.68 7.78,40.8 6.96,40.8 XIO.32
  Bottom 0.203: 17.43,62.74 17.43,62.34 21.39,58.37 21.39,56.44 22.81,55.02 22.81,54.11 23.52,53.4 25.35,53.4 26.47,54.51 JP1.6 | 17.43,62.74 17.43,65.28 IC4.9 | v14.69,43.44 14.69,53.7 15.19,54.21 15.19,61.73 16.21,62.74 17.43,62.74
PB3
  Top 0.203: XIO.31 9.5,40.9 10.93,40.9 14.28,44.25 19.97,44.25 23.93,48.21 23.93,54.51 JP1.5
PC0  (via drill 0.51)
  Top 0.203: v18.85,36.33 17.33,36.33 11.64,30.64 11.64,28.71 9.91,26.98 9.1,26.98 8.18,26.06 8.18,25.25 6.96,24.03 6.96,23.12 XIO.18 | v25.45,43.23 26.98,41.71 26.98,40.8 29.32,38.46 U1.27
  Bottom 0.203: v18.85,36.33 20.48,37.95 20.48,39.98 22.2,41.71 22.2,42.22 23.22,43.23 v25.45,43.23
PC1  (via drill 0.51)
  Top 0.203: v15.09,22.51 15.7,21.9 17.73,21.9 18.04,22.2 18.04,23.63 v24.44,30.03
  Bottom 0.203: v15.09,22.51 14.58,23.02 9.5,23.02 XIO.17 | v24.44,30.03 26.37,30.03 31.86,35.51 31.86,38.36 U1.26
PC2
  Bottom 0.203: XIO.16 6.96,20.48 7.78,20.48 9.1,19.16 15.4,19.16 17.23,17.33 29.01,17.33 33.28,21.59 33.28,26.06 35.82,28.6 35.82,33.08 39.48,36.73 39.48,38.36 U1.23
PC3  (via drill 0.51)
  Top 0.203: v17.53,28.6 9.5,20.58 XIO.15 | v20.48,28.1 20.48,28.4 27.59,35.51 29.93,35.51 31.55,33.89 v32.06,33.89
  Bottom 0.203: v17.53,28.6 19.97,28.6 v20.48,28.1 | v32.06,33.89 34.4,36.22 34.4,38.36 U1.25
PC4
  Top 0.203: XIO.14 6.86,17.94 6.86,17.12 5.64,15.9 5.64,14.99 6.35,14.28 9.91,14.28 10.72,15.09 10.72,15.5 14.38,19.16 22,19.16 24.24,21.39 24.24,23.12 U1.4
PC5
  Top 0.203: XIO.13 9.4,18.04 9.4,18.85 8.08,20.17 8.08,20.98 7.17,21.9 6.35,21.9 5.64,22.61 5.64,26.06 6.56,26.98 7.37,26.98 8.18,27.79 8.18,28.6 9.1,29.52 9.91,29.52 17.94,37.55 17.94,38.87 18.65,39.58 25.66,39.58 26.78,38.46 U1.28
PC6  (via drill 0.51)
  Top 0.203: v16.11,25.35 13.87,23.12 13.87,20.78 9.91,16.82 9.1,16.82 7.78,15.5 6.96,15.5 XIO.12
  Bottom 0.203: v16.11,25.35 19.56,25.35 21.7,23.22 U1.3
PC7
  Top 0.203: XIO.11 9.5,15.5 9.5,15.8 14.28,20.58 14.28,22.91 15.9,24.54 16.51,24.54 19.66,27.69 19.66,37.95 19.26,38.36 U1.31
PD7  (via drill 0.51)
  Top 0.203: v16.62,61.93 18.44,63.76 18.44,66.09 19.46,67.11 20.27,67.11 22,65.38 22.41,65.38 IC4.11 | v17.84,35.41 17.84,30.33 13.16,25.66 9.5,25.66 XIO.19
  Bottom 0.203: v16.62,61.93 16.62,59.19 16.31,58.88 16.31,56.44 17.63,55.12 17.63,42.62 17.23,42.22 17.23,39.48 17.84,38.87 v17.84,35.41
PE4
  Top 0.203: R3.1 50.75,19.16 50.75,15.5 50.85,15.4 50.85,8.59 45.06,2.8 PWML.3
PE5
  Bottom 0.203: R4.1 34.6,19.16 35.41,19.16 47.5,7.07 47.5,2.8 PWML.4
PG0
  Bottom 0.203: XIO.22 6.96,28.2 7.78,28.2 9.1,29.52 10.21,29.52 13.57,32.87 18.75,32.87 24.24,38.36 U1.29
PG1
  Bottom 0.203: XIO.21 9.5,28.2 12.45,31.14 26.88,31.14 30.64,34.9 30.64,38.87 31.45,39.68 35.72,39.68 36.94,38.46 U1.24
PG2  (via drill 0.51)
  Top 0.203: v52.38,30.13 58.98,23.52 IC1.11 | v36.63,28.91 36.12,28.91 35.31,29.72 33.18,29.72 v30.64,27.18
  Bottom 0.203: v52.38,30.13 42.73,30.13 41.51,28.91 v36.63,28.91 | v30.64,27.18 25.05,27.18 24.84,26.98 22.81,26.98 19.46,30.33 12.35,30.33 10.62,28.6 10.62,27.69 9.71,26.78 8.08,26.78 6.96,25.66 XIO.20
PL0  (via drill 0.51)
  Top 0.203: v82.86,45.67 65.38,45.67 65.18,45.47 v50.75,45.47 | v22.51,49.23 18.34,45.06 10.21,45.06 9.71,44.56 v8.39,44.56
  Bottom 0.203: v82.86,45.67 81.94,44.76 81.94,42.32 IC3.9 | v50.75,45.47 32.67,45.47 31.75,46.38 31.75,48.01 30.54,49.23 v22.51,49.23 | v8.39,44.56 8.39,44.05 8.08,43.74 8.08,39.48 6.96,38.36 XIO.30
PL1  (via drill 0.51)
  Top 0.203: v95.66,24.54 95.36,24.54 94.75,23.93 93.12,23.93 IC2.1 | v91.19,35.01 90.89,35.01 90.38,34.5 v87.63,34.5 | v77.78,37.24 67.52,37.24 v67.11,37.65 64.57,40.19 v63.55,40.19 | v13.87,51.87 18.85,51.87 v19.87,52.89 | v28.6,50.04 28.6,48.92 28.5,48.82 28.5,46.38 v29.82,45.06 | v50.96,44.05 54.51,44.05 56.14,42.42 56.14,41.51 v57.46,40.19
  Bottom 0.203: v95.66,24.54 95.66,25.15 94.85,25.96 94.85,34.4 94.14,35.11 91.29,35.11 v91.19,35.01 | v87.63,34.5 87.13,34.5 86.11,35.51 84.28,35.51 82.35,37.44 82.35,37.65 81.94,38.05 78.59,38.05 v77.78,37.24 | v67.11,37.65 64.16,34.7 IC3.1 | v13.87,51.87 13.06,51.06 13.06,38.56 12.04,37.55 11.43,37.55 10.72,38.26 9.5,38.26 XIO.29 | v19.87,52.89 19.87,52.38 19.77,52.28 19.77,51.46 21.19,50.04 v28.6,50.04 | v29.82,45.06 49.94,45.06 v50.96,44.05 | v63.55,40.19 v57.46,40.19
PL2  (via drill 0.51)
  Top 0.203: v90.48,26.47 93.02,26.47 IC2.2 | v90.48,31.25 88.65,31.25 v88.34,31.55 | v95.05,37.75 97.79,40.49 98.2,40.49 98.81,41.1 98.81,46.69 98.2,47.3 88.45,47.3 v87.63,46.49 | v71.17,63.35 24.74,63.35 23.93,64.16 23.93,65.99 22.41,67.52 17.33,67.52 12.76,62.95 11.94,62.95 8.18,59.19 8.18,49.74 4.02,45.57 4.02,39.48 6.86,36.63 6.86,35.82 XIO.28
  Bottom 0.203: v90.48,31.25 v90.48,26.47 | v88.34,31.55 88.34,33.99 88.75,34.4 88.75,35.92 90.58,37.75 v95.05,37.75 | IC3.2 66.7,34.6 68.43,32.87 69.55,32.87 70.26,33.58 70.26,35.41 71.28,36.43 71.89,36.43 75.34,39.88 75.34,43.03 76.36,44.05 80.01,44.05 82.45,46.49 v87.63,46.49 88.45,47.3 88.45,51.26 88.04,51.67 83.77,51.67 78.9,56.54 78.9,57.87 72.8,63.96 71.99,63.96 71.38,63.35 v71.17,63.35
PL3
  Bottom 0.203: U$1.4 30.54,78.08 28.6,80.01 25.15,80.01 24.13,79 24.13,76.66 20.88,73.41 19.36,73.41 16.21,70.26 16.21,66.7 12.04,62.54 11.54,62.54 10.82,61.83 10.82,51.67 11.23,51.26 11.23,41 9.71,39.48 8.89,39.48 8.18,38.76 8.18,37.04 9.4,35.82 XIO.27
PL4
  Top 0.203: U$1.6 35.62,77.98 31.04,73.41 16.62,73.41 11.54,68.33 8.49,68.33 4.02,63.86 4.02,46.18 3.61,45.77 3.61,36.53 6.86,33.28 XIO.26
PL5  (via drill 0.51)
  Top 0.203: v24.34,40.8 24.34,43.34 27.79,46.79 27.79,55.02 30.03,57.26 30.03,57.66 IC4.3
  Bottom 0.203: v24.34,40.8 24.34,40.19 22.91,38.76 22.91,37.85 18.34,33.28 9.5,33.28 XIO.25
PL6
  Bottom 0.203: XIO.24 6.86,30.64 6.86,29.82 5.64,28.6 5.64,25.15 6.46,24.34 18.04,24.34 19.16,23.22 U1.2
PL7  (via drill 0.51)
  Top 0.203: v16.82,47.7 18.24,47.7 22.71,52.18 22.71,55.02 24.95,57.26 24.95,57.66 IC4.5 | v14.69,35.92 9.5,30.74 XIO.23
  Bottom 0.203: v16.82,47.7 16.82,44.35 14.69,42.22 v14.69,35.92
RXD1  (via drill 0.51)
  Top 0.203: OK1.6 52.58,57.15 52.58,53.8 R12.1 52.48,53.7 50.55,53.7 48.92,52.07 48.92,50.14 48.01,49.23 45.88,49.23 44.66,48.01 44.66,46.28 44.25,45.88 42.83,45.88 39.17,42.22 39.17,41.71 38.16,40.7 v38.16,40.29 | v28.6,15.6 28.6,1.88 27.69,0.97 24.24,0.97 22.51,2.7 22.2,2.7 COMMUNICATION.3 | v35.72,27.28 35.72,28.1 v34.9,28.91
  Bottom 0.203: v28.6,15.6 35.72,22.71 v35.72,27.28 | v34.9,28.91 34.9,32.77 38.16,36.02 v38.16,40.29
RXD2  (via drill 0.51)
  Top 0.203: R11.1 68.53,53.8 68.53,57.15 68.74,57.36 OK2.6 | v107.14,19.16 107.14,45.88 96.37,56.65 84.28,56.65 77.78,63.15 v72.39,63.15
  Bottom 0.203: v107.14,19.16 88.55,0.56 29.72,0.56 27.59,2.7 27.28,2.7 COMMUNICATION.5 | v72.39,63.15 72.39,61.02 68.84,57.46 OK2.6
TXD1  (via drill 0.51)
  Top 0.203: v29.32,48.42 31.35,48.42 31.75,48.01 31.75,46.38 32.26,45.88 39.17,45.88 39.37,46.08 39.37,48.01 38.76,48.62 38.76,57.87 R8.2 | v19.56,45.06 18.95,45.06 18.55,44.66 12.35,44.66 9.71,42.02 6.35,42.02 v4.83,40.49
  Bottom 0.203: v29.32,48.42 22.91,48.42 v19.56,45.06 | v4.83,40.49 4.83,5.74 5.64,4.93 5.64,4.83 6.56,3.92 9.91,3.92 10.82,3 10.82,2.09 11.94,0.97 22.91,0.97 24.64,2.7 COMMUNICATION.4
TXD2  (via drill 0.51)
  Top 0.203: v46.08,36.12 44.25,36.12 40.39,32.26 32.67,32.26 27.39,26.98 27.39,24.34 28.2,23.52 28.2,22.2 29.72,20.68 29.72,2.8 COMMUNICATION.6
  Bottom 0.203: v46.08,36.12 54.61,36.12 55.43,36.94 61.73,36.94 65.18,40.39 65.18,43.03 66.2,44.05 67.82,44.05 69.85,46.08 69.85,47.81 71.48,49.43 71.48,51.77 76.66,56.95 77.07,56.95 R9.2
VIN
  Bottom 0.305: POWER.8 54.75,51.01 S1.2

## Text on the board
tPlace: DB5 | DB7 | K | JP-LCD | HD44780 | GND | +5V | V0 | RS | R/W | E | DB4 | DB6 | A | BUTTON1 | BUTTON4 | 3FTH9 | 3FTH9 | BUTTON2 | VIN | BUTTON3 | 3FTH9 | 3FTH9 | 3V3 | GND | GND | 5V | JP LCD OLED | ADC3 | ADC2 | ADC2 | ADC1 | GND | GND | PB0 | PB1 | PWR SW | PB2 | PB3 | PL0 | PL1 | PL2 | PL3 | PL4 | PL5 | SRAM AS6C1008-55PCN | PL6 | PL7 | 128K x 8 | PG0 | PG1 | PG2 | PD7 | PC0 | PC1 | PC2 | PC3 | PC4 | PC5 | PC6 | PC7 | PA7 | PA6 | PA5 | PA4 | PA3 | PA2 | MEGACOMMAND 1.0.1 | PA1 | PA0 | PA0 | TXD1 | TXD2 | PE4 | PE5 | 5V | RXD1 | RXD2 | GND
bPlace: RXD1 | TXD1 | RXD2 | TXD2 | VIN | GND | 5V | 3V | GND | CLK | DO | DI | CS | CD | Micro SD